# EAGLE schematic tissue board v2 (EAGLE 6.2)
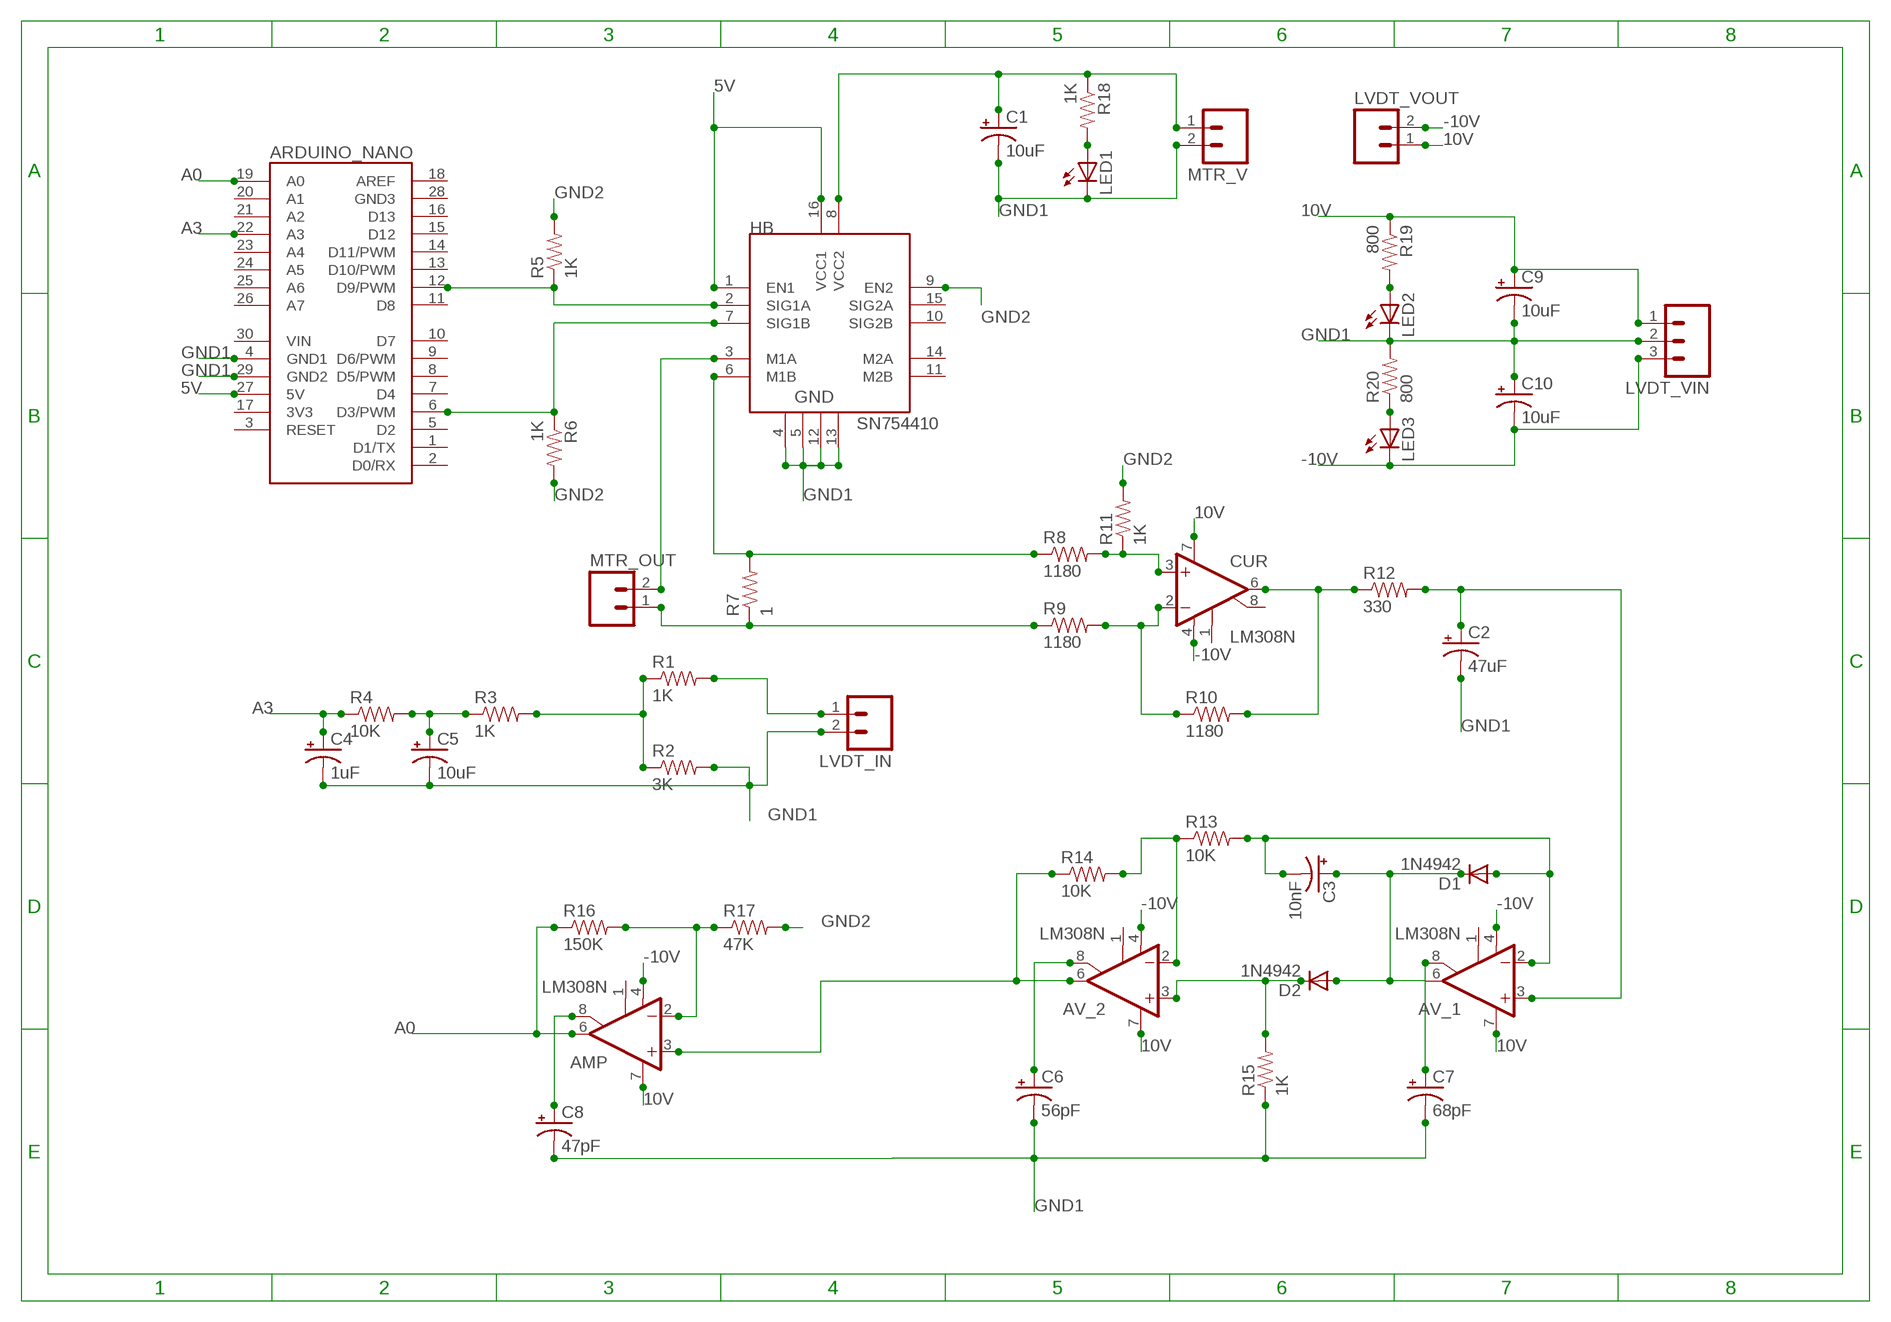
[diagram p0: schematic, sheet 1]

## Parts
AMP  LM308N  [DIL08]
ARDUINO_NANO  ARDUINO_NANO  [ARDUINO_NANO]
AV_1  LM308N  [DIL08]
AV_2  LM308N  [DIL08]
C1  10uF  CAP_POLPTH2  [CPOL-RADIAL-10UF-25V]
C2  47uF  CAP_POLPTH2  [CPOL-RADIAL-10UF-25V]
C3  10nF  CAP_POLPTH2  [CPOL-RADIAL-10UF-25V]
C4  1uF  CAP_POLPTH2  [CPOL-RADIAL-10UF-25V]
C5  10uF  CAP_POLPTH2  [CPOL-RADIAL-10UF-25V]
C6  56pF  CAP_POLPTH2  [CPOL-RADIAL-10UF-25V]
C7  68pF  CAP_POLPTH2  [CPOL-RADIAL-10UF-25V]
C8  47pF  CAP_POLPTH2  [CPOL-RADIAL-10UF-25V]
C9  10uF  CAP_POLPTH2  [CPOL-RADIAL-10UF-25V]
C10  10uF  CAP_POLPTH2  [CPOL-RADIAL-10UF-25V]
CUR  LM308N  [DIL08]
D1  1N4942  [DO41-10]
D2  1N4942  [DO41-10]
HB  SN754410  [DIP16]
LED1  LED3MM  [LED3MM]
LED2  LED3MM  [LED3MM]
LED3  LED3MM  [LED3MM]
LVDT_IN  M023.5MM  [SCREWTERMINAL-3.5MM-2]
LVDT_VIN  M03SCREW  [SCREWTERMINAL-3.5MM-3]
LVDT_VOUT  M023.5MM  [SCREWTERMINAL-3.5MM-2]
MTR_OUT  M023.5MM  [SCREWTERMINAL-3.5MM-2]
MTR_V  M023.5MM  [SCREWTERMINAL-3.5MM-2]
R1  1K  RESISTORPTH-1/4W  [AXIAL-0.4]
R2  3K  RESISTORPTH-1/4W  [AXIAL-0.4]
R3  1K  RESISTORPTH-1/4W  [AXIAL-0.4]
R4  10K  RESISTORPTH-1/4W  [AXIAL-0.4]
R5  1K  RESISTORPTH-1/4W  [AXIAL-0.4]
R6  1K  RESISTORPTH-1/4W  [AXIAL-0.4]
R7  1  RESISTORPTH-2W  [AXIAL-0.8]
R8  1180  RESISTORPTH-1/4W  [AXIAL-0.4]
R9  1180  RESISTORPTH-1/4W  [AXIAL-0.4]
R10  1180  RESISTORPTH-1/4W  [AXIAL-0.4]
R11  1K  RESISTORPTH-1/4W  [AXIAL-0.4]
R12  330  RESISTORPTH-1/4W  [AXIAL-0.4]
R13  10K  RESISTORPTH-1/4W  [AXIAL-0.4]
R14  10K  RESISTORPTH-1/4W  [AXIAL-0.4]
R15  1K  RESISTORPTH-1/4W  [AXIAL-0.4]
R16  150K  RESISTORPTH-1/4W  [AXIAL-0.4]
R17  47K  RESISTORPTH-1/4W  [AXIAL-0.4]
R18  1K  RESISTORPTH-1/4W  [AXIAL-0.4]
R19  800  RESISTORPTH-1/4W  [AXIAL-0.4]
R20  800  RESISTORPTH-1/4W  [AXIAL-0.4]

## Nets
5V: ARDUINO_NANO.27(5V) HB.1(EN1) HB.16(VCC1)
10V: AMP.7(V+) AV_1.7(V+) AV_2.7(V+) C9.1(+) CUR.7(V+) LVDT_VIN.1 LVDT_VOUT.1 R19.P$1
-10V: AMP.4(V-) AV_1.4(V-) AV_2.4(V-) C10.2(-) CUR.4(V-) LED3.K(C) LVDT_VIN.3 LVDT_VOUT.2
A0: AMP.6(OUT) ARDUINO_NANO.19(A0) R16.P$1
A3: ARDUINO_NANO.22(A3) C4.1(+) R4.P$1
GND1: ARDUINO_NANO.4(GND1) ARDUINO_NANO.29(GND2) C1.2(-) C2.2(-) C4.2(-) C5.2(-) C6.2(-) C7.2(-) C8.2(-) C9.2(-) C10.1(+) HB.4 HB.5 HB.12 HB.13 LED1.K(C) LED2.K(C) LVDT_IN.2 LVDT_VIN.2 MTR_V.2 R2.P$2 R15.P$1 R20.P$2
GND2: HB.9(EN2) R5.P$2 R6.P$2 R11.P$2 R17.P$2
LVDT: LVDT_IN.1 R1.P$2
MOTOR: ARDUINO_NANO.6(D3/PWM) HB.7(SIG1B) R6.P$1
N$1: R1.P$1 R2.P$1 R3.P$2
N$2: MTR_OUT.1 R7.P$1 R9.P$1
N$3: C1.1(+) HB.8(VCC2) MTR_V.1 R18.P$1
N$4: HB.3(M1A) MTR_OUT.2
N$5: LED1.A R18.P$2
N$6: ARDUINO_NANO.12(D9/PWM) HB.2(SIG1A) R5.P$1
N$7: CUR.2(-IN) R9.P$2 R10.P$1
N$8: LED2.A R19.P$2
N$9: C5.1(+) R3.P$1 R4.P$2
N$10: AV_1.3(+IN) C2.1(+) R12.P$2
N$11: LED3.A R20.P$1
N$12: CUR.6(OUT) R10.P$2 R12.P$1
N$13: HB.6(M1B) R7.P$2 R8.P$1
N$14: CUR.3(+IN) R8.P$2 R11.P$1
N$15: AV_2.8(CMP2) C6.1(+)
N$16: AV_1.2(-IN) C3.2(-) D1.A R13.P$2
N$17: AV_1.6(OUT) C3.1(+) D1.C D2.A
N$18: AV_2.2(-IN) R13.P$1 R14.P$2
N$19: AMP.3(+IN) AV_2.6(OUT) R14.P$1
N$20: AV_2.3(+IN) D2.C R15.P$2
N$21: AMP.2(-IN) R16.P$2 R17.P$1
N$22: AV_1.8(CMP2) C7.1(+)
N$25: AMP.8(CMP2) C8.1(+)
Unconnected: AMP.1(CMP1) ARDUINO_NANO.1(D1/TX) ARDUINO_NANO.2(D0/RX) ARDUINO_NANO.3(RESET) ARDUINO_NANO.5(D2) ARDUINO_NANO.7(D4) ARDUINO_NANO.8(D5/PWM) ARDUINO_NANO.9(D6/PWM) ARDUINO_NANO.10(D7) ARDUINO_NANO.11(D8) ARDUINO_NANO.13(D10/PWM) ARDUINO_NANO.14(D11/PWM) ARDUINO_NANO.15(D12) ARDUINO_NANO.16(D13) ARDUINO_NANO.18(AREF) ARDUINO_NANO.20(A1) ARDUINO_NANO.21(A2) ARDUINO_NANO.23(A4) ARDUINO_NANO.24(A5) ARDUINO_NANO.25(A6) ARDUINO_NANO.26(A7) ARDUINO_NANO.28(GND3) ARDUINO_NANO.30(VIN) AV_1.1(CMP1) AV_2.1(CMP1) CUR.1(CMP1) CUR.8(CMP2) HB.10(SIG2B) HB.11(M2B) HB.14(M2A) HB.15(SIG2A)

## Power pins joined to a net without a drawn wire
3V3: ARDUINO_NANO.17(3V3)

## Library data of the parts
AMP AV_1 AV_2 CUR = linear:LM308: OP AMP
ARDUINO_NANO = arduino:ARDUINO_NANO: Arduino Nano I/O pin arrangement
C1-C10 = SparkFun:CAP_POL: Capacitor Polarized These are standard SMD and PTH capacitors. Normally 10uF, 47uF, and 100uF in electrolytic and tantalum varieties. Always verify the external diameter of the through hole cap, it varies with capacity, voltage, and manufacturer. The EIA devices should be standard.
D1 D2 = diode:1N4942: DIODE 1.0 A, 200 V, 150 ns
HB = HBridge:SN754410: Quadruple half-H driver
LED1-LED3 = led:LED: LED OSRAM: - CHIPLED LG R971, LG N971, LY N971, LG Q971, LY Q971, LO R971, LY R971 LH N974, LH R974 LS Q976, LO Q976, LY Q976 LO Q996 - Hyper CHIPLED LW Q18S LB Q993, LB Q99A, LB R99A - SideLED LS A670, LO A670, LY A670, LG A670, LP A670 LB A673, LV A673, LT A673, LW A673 LH A674 LY A675 LS A676, LA A676, LO A676, LY A676, LW A676 LS A679, LY A679, LG A679 - Hyper Micro SIDELED® LS Y876, LA Y876, LO Y876, LY Y876 LT Y87S - SmartLED LW L88C, LW L88S LB L89C, LB L89S, LG L890 LS L89K, LO L89K, LY L89K LS L896, LA L896, LO L896, LY L896 - TOPLED LS T670, LO T670, LY T670, LG T670, LP T670 LSG T670, LSP T670, LSY T670, LOP T670, LYG T670 LG T671, LOG T671, LSG T671 LB T673, LV T673, LT T673, LW T673 LH T674 LS T676, LA T676, LO T676, LY T676, LB T676, LH T676, LSB T676, LW T676 LB T67C, LV T67C, LT T67C, LS T67K, LO T67K, LY T67K, LW E67C LS E67B, LA E67B, LO E67B, LY E67B, LB E67C, LV E67C, LT E67C LW T67C LS T679, LY T679, LG T679 LS T770, LO T770, LY T770, LG T770, LP T770 LB T773, LV T773, LT T773, LW T773 LH T774 LS E675, LA E675, LY E675, LS T675 LS T776, LA T776, LO T776, LY T776, LB T776 LHGB T686 LT T68C, LB T68C - Hyper Mini TOPLED® LB M676 - Mini TOPLED Santana® LG M470 LS M47K, LO M47K, LY M47K Source: http://www.osram.convergy.de LUXEON: - LUMILED® LXK2-PW12-R00, LXK2-PW12-S00, LXK2-PW14-U00, LXK2-PW14-V00 LXK2-PM12-R00, LXK2-PM12-S00, LXK2-PM14-U00 LXK2-PE12-Q00, LXK2-PE12-R00, LXK2-PE12-S00, LXK2-PE14-T00, LXK2-PE14-U00 LXK2-PB12-K00, LXK2-PB12-L00, LXK2-PB12-M00, LXK2-PB14-N00, LXK2-PB14-P00, LXK2-PB14-Q00 LXK2-PR12-L00, LXK2-PR12-M00, LXK2-PR14-Q00, LXK2-PR14-R00 LXK2-PD12-Q00, LXK2-PD12-R00, LXK2-PD12-S00 LXK2-PH12-R00, LXK2-PH12-S00 LXK2-PL12-P00, LXK2-PL12-Q00, LXK2-PL12-R00 Source: www.luxeon.com KINGBRIGHT: KA-3528ASYC Source: www.kingbright.com
LVDT_IN LVDT_VOUT MTR_OUT MTR_V = SparkFun:M02: Header 2 Standard 2-pin 0.1" header. Use with straight break away headers (SKU : PRT-00116), right angle break away headers (PRT-00553), swiss pins (PRT-00743), machine pins (PRT-00117), and female headers (PRT-00115). Molex polarized connector foot print use with SKU : PRT-08233 with associated crimp pins and housings.
LVDT_VIN = SparkFun:M03: Header 3 Standard 3-pin 0.1" header. Use with straight break away headers (SKU : PRT-00116), right angle break away headers (PRT-00553), swiss pins (PRT-00743), machine pins (PRT-00117), and female headers (PRT-00115). Molex polarized connector foot print use with SKU : PRT-08232 with associated crimp pins and housings.
R1-R20 = SparkFun:RESISTOR: Resistor Basic schematic elements and footprints for 0603, 1206, and PTH resistors.